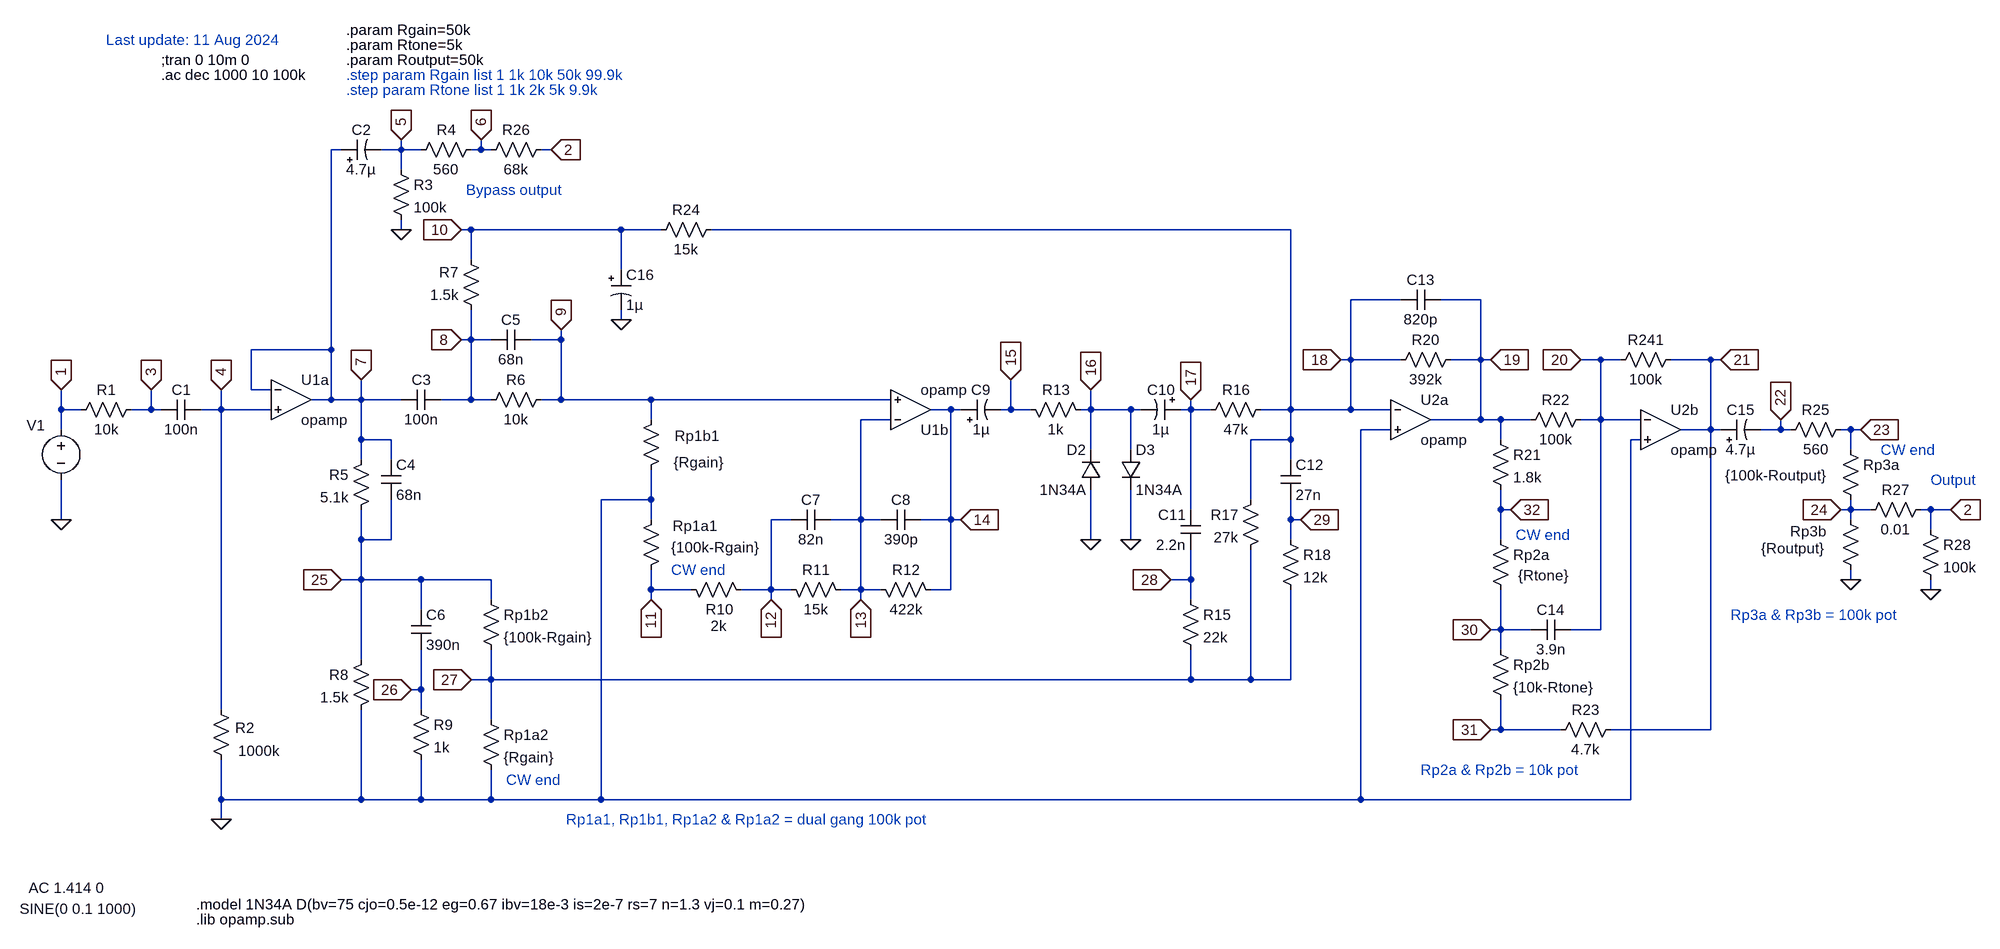
[diagram p0: schematic Klon-Centaur_v1.asc]
Klon-Centaur_v1.asc, the LTspice schematic file:
Version 4
SHEET 1 4496 5064
WIRE -336 2128 -352 2128
WIRE -240 2128 -240 2112
WIRE -240 2128 -272 2128
WIRE -208 2128 -240 2128
WIRE -112 2128 -112 2112
WIRE -112 2128 -128 2128
WIRE -96 2128 -112 2128
WIRE 0 2128 -16 2128
WIRE -240 2160 -240 2128
WIRE -240 2256 -240 2240
WIRE -128 2256 -144 2256
WIRE 112 2256 -128 2256
WIRE 176 2256 112 2256
WIRE 1184 2256 256 2256
WIRE -128 2304 -128 2256
WIRE 112 2320 112 2256
WIRE 1360 2368 1280 2368
WIRE 1488 2368 1424 2368
WIRE 112 2400 112 2384
WIRE -128 2432 -128 2384
WIRE -128 2432 -144 2432
WIRE -96 2432 -128 2432
WIRE 16 2432 16 2416
WIRE 16 2432 -32 2432
WIRE -352 2448 -352 2128
WIRE -352 2448 -480 2448
WIRE 1280 2464 1280 2368
WIRE 1280 2464 1264 2464
WIRE 1360 2464 1280 2464
WIRE 1488 2464 1488 2368
WIRE 1488 2464 1440 2464
WIRE 1504 2464 1488 2464
WIRE 1680 2464 1648 2464
WIRE 1712 2464 1680 2464
WIRE 1856 2464 1792 2464
WIRE 1872 2464 1856 2464
WIRE -480 2512 -480 2448
WIRE -448 2512 -480 2512
WIRE -352 2528 -352 2448
WIRE -352 2528 -384 2528
WIRE -304 2528 -304 2496
WIRE -304 2528 -352 2528
WIRE -240 2528 -304 2528
WIRE -128 2528 -128 2432
WIRE -128 2528 -176 2528
WIRE -96 2528 -128 2528
WIRE 16 2528 16 2432
WIRE 16 2528 -16 2528
WIRE 160 2528 16 2528
WIRE 544 2528 160 2528
WIRE -784 2544 -784 2512
WIRE -752 2544 -784 2544
WIRE -640 2544 -640 2512
WIRE -640 2544 -672 2544
WIRE -624 2544 -640 2544
WIRE -528 2544 -528 2512
WIRE -528 2544 -560 2544
WIRE -448 2544 -528 2544
WIRE 640 2544 608 2544
WIRE 656 2544 640 2544
WIRE 736 2544 736 2496
WIRE 736 2544 720 2544
WIRE 768 2544 736 2544
WIRE 864 2544 864 2512
WIRE 864 2544 848 2544
WIRE 928 2544 864 2544
WIRE 944 2544 928 2544
WIRE 1024 2544 1024 2528
WIRE 1024 2544 1008 2544
WIRE 1056 2544 1024 2544
WIRE 1184 2544 1184 2256
WIRE 1184 2544 1136 2544
WIRE 1280 2544 1280 2464
WIRE 1280 2544 1184 2544
WIRE 1344 2544 1280 2544
WIRE 160 2560 160 2528
WIRE 544 2560 496 2560
WIRE 1488 2560 1488 2464
WIRE 1488 2560 1408 2560
WIRE 1520 2560 1488 2560
WIRE 1568 2560 1520 2560
WIRE 1680 2560 1680 2464
WIRE 1680 2560 1648 2560
WIRE 1744 2560 1680 2560
WIRE -784 2576 -784 2544
WIRE 1344 2576 1296 2576
WIRE 1856 2576 1856 2464
WIRE 1856 2576 1808 2576
WIRE 1872 2576 1856 2576
WIRE 1968 2576 1968 2560
WIRE 1968 2576 1936 2576
WIRE 1984 2576 1968 2576
WIRE 2080 2576 2064 2576
WIRE 2096 2576 2080 2576
WIRE -304 2592 -304 2528
WIRE -256 2592 -304 2592
WIRE 1184 2592 1184 2544
WIRE 1184 2592 1120 2592
WIRE 1520 2592 1520 2560
WIRE 1744 2592 1728 2592
WIRE 864 2608 864 2544
WIRE 928 2608 928 2544
WIRE 2080 2608 2080 2576
WIRE -304 2624 -304 2592
WIRE -256 2624 -256 2592
WIRE 1184 2624 1184 2592
WIRE 160 2688 160 2640
WIRE 160 2688 80 2688
WIRE 1120 2688 1120 2592
WIRE 1024 2704 1024 2544
WIRE 1520 2704 1520 2672
WIRE 1536 2704 1520 2704
WIRE 2080 2704 2080 2688
WIRE 2080 2704 2064 2704
WIRE 2112 2704 2080 2704
WIRE 2208 2704 2192 2704
WIRE 2240 2704 2208 2704
WIRE -784 2720 -784 2656
WIRE 160 2720 160 2688
WIRE 384 2720 352 2720
WIRE 496 2720 496 2560
WIRE 496 2720 448 2720
WIRE 528 2720 496 2720
WIRE 640 2720 640 2544
WIRE 640 2720 592 2720
WIRE 656 2720 640 2720
WIRE 1184 2720 1184 2688
WIRE 1200 2720 1184 2720
WIRE 2080 2720 2080 2704
WIRE 2208 2736 2208 2704
WIRE -304 2752 -304 2704
WIRE -256 2752 -256 2688
WIRE -256 2752 -304 2752
WIRE 864 2752 864 2672
WIRE 928 2752 928 2672
WIRE 1184 2752 1184 2720
WIRE 1520 2752 1520 2704
WIRE -304 2816 -304 2752
WIRE -304 2816 -336 2816
WIRE -208 2816 -304 2816
WIRE -96 2816 -208 2816
WIRE 1024 2816 1024 2768
WIRE 1024 2816 992 2816
WIRE 2080 2816 2080 2800
WIRE 160 2832 160 2800
WIRE 224 2832 160 2832
WIRE 352 2832 352 2720
WIRE 352 2832 304 2832
WIRE 384 2832 352 2832
WIRE 496 2832 496 2720
WIRE 496 2832 464 2832
WIRE 528 2832 496 2832
WIRE 640 2832 640 2720
WIRE 640 2832 608 2832
WIRE 2208 2832 2208 2816
WIRE -96 2848 -96 2816
WIRE 160 2848 160 2832
WIRE 352 2848 352 2832
WIRE 496 2848 496 2832
WIRE 1024 2848 1024 2816
WIRE -208 2864 -208 2816
WIRE 1520 2896 1520 2832
WIRE 1520 2896 1504 2896
WIRE 1568 2896 1520 2896
WIRE 1680 2896 1680 2560
WIRE 1680 2896 1632 2896
WIRE 1520 2928 1520 2896
WIRE -304 2944 -304 2816
WIRE -96 2976 -96 2928
WIRE -96 2976 -128 2976
WIRE 1024 2976 1024 2928
WIRE 1024 2976 -96 2976
WIRE 1120 2976 1120 2768
WIRE 1120 2976 1024 2976
WIRE 1184 2976 1184 2832
WIRE 1184 2976 1120 2976
WIRE -208 2992 -208 2928
WIRE -208 2992 -224 2992
WIRE -528 3024 -528 2544
WIRE -208 3024 -208 2992
WIRE -96 3040 -96 2976
WIRE 1520 3056 1520 3008
WIRE 1520 3056 1504 3056
WIRE 1616 3056 1520 3056
WIRE 1856 3056 1856 2576
WIRE 1856 3056 1696 3056
WIRE -528 3168 -528 3104
WIRE -304 3168 -304 3024
WIRE -304 3168 -528 3168
WIRE -208 3168 -208 3104
WIRE -208 3168 -304 3168
WIRE -96 3168 -96 3120
WIRE -96 3168 -208 3168
WIRE 80 3168 80 2688
WIRE 80 3168 -96 3168
WIRE 1296 3168 1296 2576
WIRE 1296 3168 80 3168
WIRE 1728 3168 1728 2592
WIRE 1728 3168 1296 3168
WIRE -528 3200 -528 3168
FLAG -784 2512 1
IOPIN -784 2512 In
FLAG 928 2752 0
FLAG 864 2752 0
FLAG 112 2400 0
FLAG -528 3200 0
FLAG -784 2720 0
FLAG -240 2256 0
FLAG -640 2512 3
IOPIN -640 2512 In
FLAG -528 2512 4
IOPIN -528 2512 In
FLAG -304 2496 7
IOPIN -304 2496 In
FLAG -240 2112 5
IOPIN -240 2112 In
FLAG -144 2432 8
IOPIN -144 2432 In
FLAG -144 2256 10
IOPIN -144 2256 In
FLAG 16 2416 9
IOPIN 16 2416 In
FLAG 736 2496 15
IOPIN 736 2496 In
FLAG 864 2512 16
IOPIN 864 2512 In
FLAG 1024 2528 17
IOPIN 1024 2528 In
FLAG 992 2816 28
IOPIN 992 2816 In
FLAG 1200 2720 29
IOPIN 1200 2720 In
FLAG -128 2976 27
IOPIN -128 2976 In
FLAG -224 2992 26
IOPIN -224 2992 In
FLAG -336 2816 25
IOPIN -336 2816 In
FLAG 1536 2704 32
IOPIN 1536 2704 In
FLAG 1504 2896 30
IOPIN 1504 2896 In
FLAG 1504 3056 31
IOPIN 1504 3056 In
FLAG 1264 2464 18
IOPIN 1264 2464 In
FLAG 1504 2464 19
IOPIN 1504 2464 In
FLAG 1648 2464 20
IOPIN 1648 2464 In
FLAG 1872 2464 21
IOPIN 1872 2464 In
FLAG 1968 2560 22
IOPIN 1968 2560 In
FLAG 0 2128 2
IOPIN 0 2128 In
FLAG -112 2112 6
IOPIN -112 2112 In
FLAG 2240 2704 2
IOPIN 2240 2704 In
FLAG 2208 2832 0
FLAG 2080 2816 0
FLAG 2064 2704 24
IOPIN 2064 2704 In
FLAG 2096 2576 23
IOPIN 2096 2576 In
FLAG 160 2848 11
IOPIN 160 2848 In
FLAG 352 2848 12
IOPIN 352 2848 In
FLAG 496 2848 13
IOPIN 496 2848 In
FLAG 656 2720 14
IOPIN 656 2720 In
SYMBOL voltage -784 2560 R0
WINDOW 0 -55 9 Left 2
WINDOW 123 -52 749 Left 2
WINDOW 39 0 0 Left 0
WINDOW 3 -66 783 Left 2
SYMATTR InstName V1
SYMATTR Value2 AC 1.414 0
SYMATTR Value SINE(0 0.1 1000)
SYMBOL res -656 2528 R90
WINDOW 0 0 56 VBottom 2
WINDOW 3 32 56 VTop 2
SYMATTR InstName R1
SYMATTR Value 10k
SYMBOL res -512 3120 R180
WINDOW 0 -37 67 Left 2
WINDOW 3 -77 30 Left 2
SYMATTR InstName R2
SYMATTR Value 1000k
SYMBOL cap -560 2528 R90
WINDOW 0 0 32 VBottom 2
WINDOW 3 32 32 VTop 2
SYMATTR InstName C1
SYMATTR Value 100n
SYMBOL res -288 2608 M0
SYMATTR InstName R5
SYMATTR Value 5.1k
SYMBOL res -288 2928 M0
SYMATTR InstName R8
SYMATTR Value 1.5k
SYMBOL cap -176 2512 R90
WINDOW 0 0 32 VBottom 2
WINDOW 3 32 32 VTop 2
SYMATTR InstName C3
SYMATTR Value 100n
SYMBOL cap -272 2624 R0
SYMATTR InstName C4
SYMATTR Value 68n
SYMBOL cap -224 2864 R0
SYMATTR InstName C6
SYMATTR Value 390n
SYMBOL res -224 3008 R0
SYMATTR InstName R9
SYMATTR Value 1k
SYMBOL res 0 2512 R90
WINDOW 0 0 56 VBottom 2
WINDOW 3 32 56 VTop 2
SYMATTR InstName R6
SYMATTR Value 10k
SYMBOL cap -32 2416 R90
WINDOW 0 0 32 VBottom 2
WINDOW 3 32 32 VTop 2
SYMATTR InstName C5
SYMATTR Value 68n
SYMBOL res -112 2832 R0
SYMATTR InstName Rp1b2
SYMATTR Value {100k-Rgain}
SYMBOL res -112 3024 R0
SYMATTR InstName Rp1a2
SYMATTR Value {Rgain}
SYMBOL res 864 2560 M270
WINDOW 0 32 56 VTop 2
WINDOW 3 0 56 VBottom 2
SYMATTR InstName R13
SYMATTR Value 1k
SYMBOL cap 1040 2704 M0
SYMATTR InstName C11
SYMATTR Value 2.2n
SYMBOL res 1008 2832 R0
SYMATTR InstName R15
SYMATTR Value 22k
SYMBOL res 1136 2672 M0
SYMATTR InstName R17
SYMATTR Value 27k
SYMBOL res 1168 2736 R0
SYMATTR InstName R18
SYMATTR Value 12k
SYMBOL cap 1168 2624 R0
SYMATTR InstName C12
SYMATTR Value 27n
SYMBOL res 1152 2528 R90
WINDOW 0 0 56 VBottom 2
WINDOW 3 32 56 VTop 2
SYMATTR InstName R16
SYMATTR Value 47k
SYMBOL res -112 2400 R180
WINDOW 0 36 76 Left 2
WINDOW 3 36 40 Left 2
SYMATTR InstName R7
SYMATTR Value 1.5k
SYMBOL res 272 2240 R90
WINDOW 0 0 56 VBottom 2
WINDOW 3 32 56 VTop 2
SYMATTR InstName R24
SYMATTR Value 15k
SYMBOL res 1456 2448 R90
WINDOW 0 0 56 VBottom 2
WINDOW 3 32 56 VTop 2
SYMATTR InstName R20
SYMATTR Value 392k
SYMBOL cap 1424 2352 R90
WINDOW 0 0 32 VBottom 2
WINDOW 3 32 32 VTop 2
SYMATTR InstName C13
SYMATTR Value 820p
SYMBOL res 1504 2576 R0
SYMATTR InstName R21
SYMATTR Value 1.8k
SYMBOL res 1664 2544 R90
WINDOW 0 0 56 VBottom 2
WINDOW 3 32 56 VTop 2
SYMATTR InstName R22
SYMATTR Value 100k
SYMBOL res 1504 2736 R0
WINDOW 3 125 73 Right 2
SYMATTR Value {Rtone}
SYMATTR InstName Rp2a
SYMBOL res 1504 2912 R0
SYMATTR InstName Rp2b
SYMATTR Value {10k-Rtone}
SYMBOL cap 1632 2880 R90
WINDOW 0 0 32 VBottom 2
WINDOW 3 32 32 VTop 2
SYMATTR InstName C14
SYMATTR Value 3.9n
SYMBOL res 1808 2448 R90
WINDOW 0 0 56 VBottom 2
WINDOW 3 32 56 VTop 2
SYMATTR InstName R241
SYMATTR Value 100k
SYMBOL res 2080 2560 R90
WINDOW 0 0 56 VBottom 2
WINDOW 3 32 56 VTop 2
SYMATTR InstName R25
SYMATTR Value 560
SYMBOL res 1712 3040 R90
WINDOW 0 0 56 VBottom 2
WINDOW 3 32 56 VTop 2
SYMATTR InstName R23
SYMATTR Value 4.7k
SYMBOL OpAmps\\opamp -416 2464 R0
SYMATTR InstName U1a
SYMBOL OpAmps\\opamp 1376 2496 R0
SYMATTR InstName U2a
SYMBOL OpAmps\\opamp 1776 2512 R0
SYMATTR InstName U2b
SYMBOL res -256 2144 R0
SYMATTR InstName R3
SYMATTR Value 100k
SYMBOL res -112 2112 R90
WINDOW 0 0 56 VBottom 2
WINDOW 3 32 56 VTop 2
SYMATTR InstName R4
SYMATTR Value 560
SYMBOL diode 880 2672 R180
WINDOW 0 24 64 Left 2
WINDOW 3 24 0 Left 2
SYMATTR InstName D2
SYMATTR Value 1N34A
SYMBOL diode 912 2608 R0
SYMATTR InstName D3
SYMATTR Value 1N34A
SYMBOL polcap -336 2144 R270
WINDOW 0 32 32 VTop 2
WINDOW 3 0 32 VBottom 2
SYMATTR InstName C2
SYMATTR Value 4.7µ
SYMBOL polcap 96 2320 R0
SYMATTR InstName C16
SYMATTR Value 1µ
SYMBOL polcap 656 2560 R270
WINDOW 0 32 32 VTop 2
WINDOW 3 0 32 VBottom 2
SYMATTR InstName C9
SYMATTR Value 1µ
SYMBOL polcap 1008 2528 R90
WINDOW 0 0 32 VBottom 2
WINDOW 3 32 32 VTop 2
SYMATTR InstName C10
SYMATTR Value 1µ
SYMBOL polcap 1872 2592 R270
WINDOW 0 32 32 VTop 2
WINDOW 3 0 32 VBottom 2
SYMATTR InstName C15
SYMATTR Value 4.7µ
SYMBOL res 0 2112 R90
WINDOW 0 0 56 VBottom 2
WINDOW 3 32 56 VTop 2
SYMATTR InstName R26
SYMATTR Value 68k
SYMBOL res 2192 2720 R0
SYMATTR InstName R28
SYMATTR Value 100k
SYMBOL res 2064 2592 R0
WINDOW 3 -185 57 Left 2
SYMATTR Value {100k-Routput}
SYMATTR InstName Rp3a
SYMBOL res 2064 2704 R0
WINDOW 0 -81 35 Left 2
WINDOW 3 -127 62 Left 2
SYMATTR InstName Rp3b
SYMATTR Value {Routput}
SYMBOL res 2208 2688 R90
WINDOW 0 0 56 VBottom 2
WINDOW 3 32 56 VTop 2
SYMATTR InstName R27
SYMATTR Value 0.01
SYMBOL res 144 2816 M180
WINDOW 0 51 86 Left 2
WINDOW 3 48 52 Left 2
SYMATTR InstName Rp1a1
SYMATTR Value {100k-Rgain}
SYMBOL res 144 2656 M180
WINDOW 0 54 70 Left 2
WINDOW 3 52 28 Left 2
SYMATTR InstName Rp1b1
SYMATTR Value {Rgain}
SYMBOL res 320 2848 M270
WINDOW 0 -31 50 VTop 2
WINDOW 3 -26 52 VBottom 2
SYMATTR InstName R10
SYMATTR Value 2k
SYMBOL res 480 2848 M270
WINDOW 0 32 56 VTop 2
WINDOW 3 0 56 VBottom 2
SYMATTR InstName R11
SYMATTR Value 15k
SYMBOL cap 448 2736 M270
WINDOW 0 32 32 VTop 2
WINDOW 3 0 32 VBottom 2
SYMATTR InstName C7
SYMATTR Value 82n
SYMBOL cap 592 2736 M270
WINDOW 0 32 32 VTop 2
WINDOW 3 0 32 VBottom 2
SYMATTR InstName C8
SYMATTR Value 390p
SYMBOL res 624 2848 M270
WINDOW 0 32 56 VTop 2
WINDOW 3 0 56 VBottom 2
SYMATTR InstName R12
SYMATTR Value 422k
SYMBOL OpAmps\\opamp 576 2608 M180
SYMATTR InstName U1b
TEXT -328 1936 Left 2 !.param Rgain=50k
TEXT -328 1960 Left 2 !.param Rtone=5k
TEXT -568 3360 Left 2 !.lib opamp.sub
TEXT -624 2008 Left 2 !.ac dec 1000 10 100k
TEXT 1544 2744 Left 2 ;CW end
TEXT -72 3136 Left 2 ;CW end
TEXT -328 2008 Left 2 ;.step param Rgain list 1 1k 10k 50k 99.9k
TEXT -328 2032 Left 2 ;.step param Rtone list 1 1k 2k 5k 9.9k
TEXT 1392 3120 Left 2 ;Rp2a & Rp2b = 10k pot
TEXT 24 3200 Left 2 ;Rp1a1, Rp1b1, Rp1a2 & Rp1a2 = dual gang 100k pot
TEXT -568 3336 Left 2 !.model 1N34A D(bv=75 cjo=0.5e-12 eg=0.67 ibv=18e-3 is=2e-7 rs=7 n=1.3 vj=0.1 m=0.27)
TEXT -624 1984 Left 2 !;tran 0 10m 0
TEXT -136 2192 Left 2 ;Bypass output
TEXT 2208 2656 Left 2 ;Output
TEXT 2128 2608 Left 2 ;CW end
TEXT -328 1984 Left 2 !.param Routput=50k
TEXT 1888 2872 Left 2 ;Rp3a & Rp3b = 100k pot
TEXT 192 2800 Left 2 ;CW end
TEXT -712 1952 Left 2 ;Last update: 11 Aug 2024

The netlist it stands for:
* Klon-Centaur_v1.asc
V1 1 0 SINE(0 0.1 1000) AC 1.414 0
R1 3 1 10k
R2 0 4 1000k
C1 4 3 100n
R5 7 25 5.1k
R8 25 0 1.5k
C3 8 7 100n
C4 7 25 68n
C6 25 26 390n
R9 26 0 1k
R6 9 8 10k
C5 9 8 68n
Rp1b2 25 27 {100k-Rgain}
Rp1a2 27 0 {Rgain}
R13 16 15 1k
C11 17 28 2.2n
R15 28 27 22k
R17 18 27 27k
R18 29 27 12k
C12 18 29 27n
R16 18 17 47k
R7 8 10 1.5k
R24 18 10 15k
R20 19 18 392k
C13 19 18 820p
R21 19 32 1.8k
R22 20 19 100k
Rp2a 32 30 {Rtone}
Rp2b 30 31 {10k-Rtone}
C14 20 30 3.9n
R241 21 20 100k
R25 23 22 560
R23 21 31 4.7k
XU1a 7 4 7 opamp Aol=100K GBW=10Meg  ; pins invin noninvin out
XU2a 18 0 19 opamp Aol=100K GBW=10Meg  ; pins invin noninvin out
XU2b 20 0 21 opamp Aol=100K GBW=10Meg  ; pins invin noninvin out
R3 5 0 100k
R4 6 5 560
D2 0 16 1N34A
D3 16 0 1N34A
C2 7 5 4.7µ
C16 10 0 1µ
C9 14 15 1µ
C10 17 16 1µ
C15 21 22 4.7µ
R26 2 6 68k
R28 2 0 100k
Rp3a 23 24 {100k-Routput}
Rp3b 24 0 {Routput}
R27 2 24 0.01
Rp1a1 11 0 {100k-Rgain}
Rp1b1 0 9 {Rgain}
R10 12 11 2k
R11 13 12 15k
C7 13 12 82n
C8 14 13 390p
R12 14 13 422k
XU1b 13 9 14 opamp Aol=100K GBW=10Meg  ; pins invin noninvin out
.model D D
.lib standard.dio
.param Rgain=50k
.param Rtone=5k
.lib opamp.sub
.ac dec 1000 10 100k
* CW end
* CW end
* .step param Rgain list 1 1k 10k 50k 99.9k
* .step param Rtone list 1 1k 2k 5k 9.9k
* Rp2a & Rp2b = 10k pot
* Rp1a1, Rp1b1, Rp1a2 & Rp1a2 = dual gang 100k pot
.model 1N34A D(bv=75 cjo=0.5e-12 eg=0.67 ibv=18e-3 is=2e-7 rs=7 n=1.3 vj=0.1 m=0.27)
;tran 0 10m 0
* Bypass output
* Output
* CW end
.param Routput=50k
* Rp3a & Rp3b = 100k pot
* CW end
* Last update: 11 Aug 2024
.backanno
.end